# Altium schematic sheet TEC_DRV.SchDoc
size 420 x 297 mm; SheetNumber: 5; SheetTotal: 11
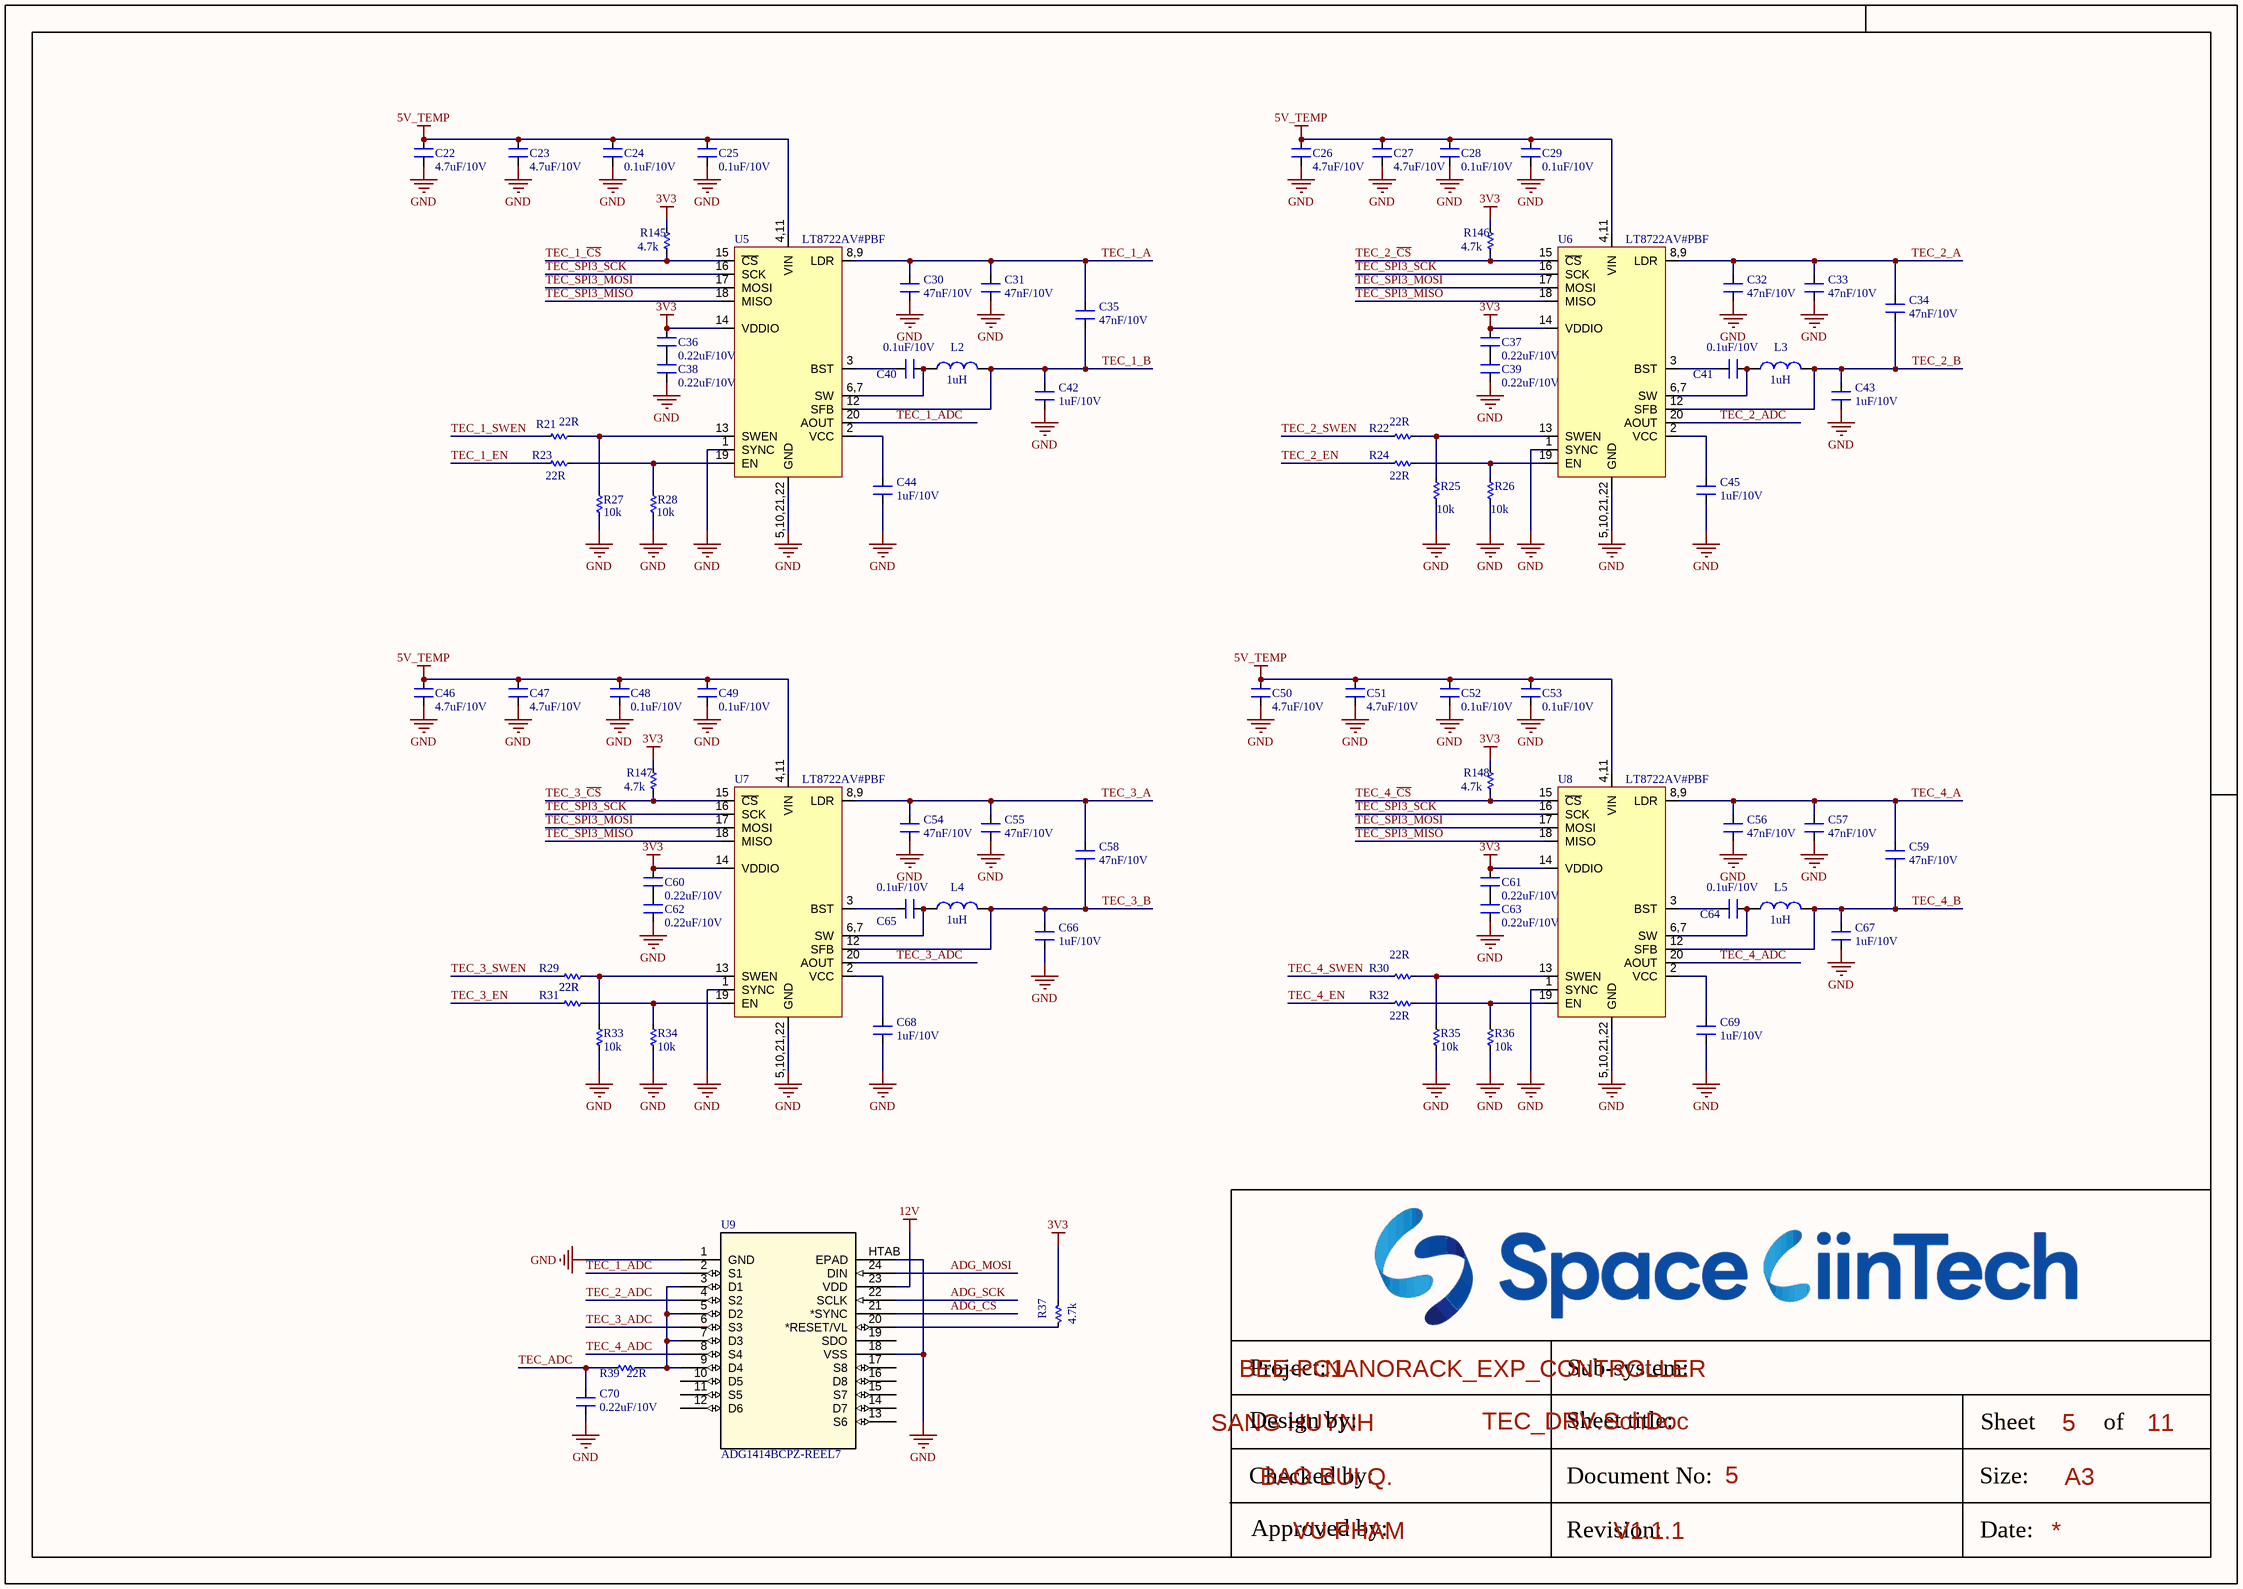
[diagram p0: TEC_DRV.SchDoc]

## Parts
C22  4.7uF/10V  [CAP_C_1608X80]
C23  4.7uF/10V  [CAP_C_1608X80]
C24  0.1uF/10V  [CAP_C_1608X80]
C25  0.1uF/10V  [CAP_C_1608X80]
C26  4.7uF/10V  [CAP_C_1608X80]
C27  4.7uF/10V  [CAP_C_1608X80]
C28  0.1uF/10V  [CAP_C_1608X80]
C29  0.1uF/10V  [CAP_C_1608X80]
C30  47nF/10V  [CAP_C_1608X80]
C31  47nF/10V  [CAP_C_1608X80]
C32  47nF/10V  [CAP_C_1608X80]
C33  47nF/10V  [CAP_C_1608X80]
C34  47nF/10V  [CAP_C_1608X80]
C35  47nF/10V  [CAP_C_1608X80]
C36  0.22uF/10V  [CAP_C_1608X80]
C37  0.22uF/10V  [CAP_C_1608X80]
C38  0.22uF/10V  [CAP_C_1608X80]
C39  0.22uF/10V  [CAP_C_1608X80]
C40  0.1uF/10V  [CAP_C_1608X80]
C41  0.1uF/10V  [CAP_C_1608X80]
C42  1uF/10V  [CAP_C_1608X80]
C43  1uF/10V  [CAP_C_1608X80]
C44  1uF/10V  [CAP_C_1608X80]
C45  1uF/10V  [CAP_C_1608X80]
C46  4.7uF/10V  [CAP_C_1608X80]
C47  4.7uF/10V  [CAP_C_1608X80]
C48  0.1uF/10V  [CAP_C_1608X80]
C49  0.1uF/10V  [CAP_C_1608X80]
C50  4.7uF/10V  [CAP_C_1608X80]
C51  4.7uF/10V  [CAP_C_1608X80]
C52  0.1uF/10V  [CAP_C_1608X80]
C53  0.1uF/10V  [CAP_C_1608X80]
C54  47nF/10V  [CAP_C_1608X80]
C55  47nF/10V  [CAP_C_1608X80]
C56  47nF/10V  [CAP_C_1608X80]
C57  47nF/10V  [CAP_C_1608X80]
C58  47nF/10V  [CAP_C_1608X80]
C59  47nF/10V  [CAP_C_1608X80]
C60  0.22uF/10V  [CAP_C_1608X80]
C61  0.22uF/10V  [CAP_C_1608X80]
C62  0.22uF/10V  [CAP_C_1608X80]
C63  0.22uF/10V  [CAP_C_1608X80]
C64  0.1uF/10V  [CAP_C_1608X80]
C65  0.1uF/10V  [CAP_C_1608X80]
C66  1uF/10V  [CAP_C_1608X80]
C67  1uF/10V  [CAP_C_1608X80]
C68  1uF/10V  [CAP_C_1608X80]
C69  1uF/10V  [CAP_C_1608X80]
C70  0.22uF/10V  [CAP_C_1608X80]
L2  1uH  [L-SMD-M-3.5x3.5x2mm]
L3  1uH  [L-SMD-M-3.5x3.5x2mm]
L4  1uH  [L-SMD-M-3.5x3.5x2mm]
L5  1uH  [L-SMD-M-3.5x3.5x2mm]
R21  22R  [RES_C_1608X60]
R22  22R  [RES_C_1608X60]
R23  22R  [RES_C_1608X60]
R24  22R  [RES_C_1608X60]
R25  10k  [RES_C_1608X60]
R26  10k  [RES_C_1608X60]
R27  10k  [RES_C_1608X60]
R28  10k  [RES_C_1608X60]
R29  22R  [RES_C_1608X60]
R30  22R  [RES_C_1608X60]
R31  22R  [RES_C_1608X60]
R32  22R  [RES_C_1608X60]
R33  10k  [RES_C_1608X60]
R34  10k  [RES_C_1608X60]
R35  10k  [RES_C_1608X60]
R36  10k  [RES_C_1608X60]
R37  4.7k  [RES_C_1608X60]
R39  22R  [RES_C_1608X60]
R145  4.7k  [RES_C_1608X60]
R146  4.7k  [RES_C_1608X60]
R147  4.7k  [RES_C_1608X60]
R148  4.7k  [RES_C_1608X60]
U5  LT8722AV#PBF  [QFN18]
U6  LT8722AV#PBF  [QFN18]
U7  LT8722AV#PBF  [QFN18]
U8  LT8722AV#PBF  [QFN18]
U9  ADG1414BCPZ-REEL7  [ADG1414BCPZ-REEL7]

## Nets
3V3: C36.2 C37.2 C60.2 C61.2 R37.2 R145.1 R146.1 R147.1 R148.1 U5.14(VDDIO) U6.14(VDDIO) U7.14(VDDIO) U8.14(VDDIO)
5V_TEMP: C22.2 C23.2 C24.2 C25.2 C26.2 C27.2 C28.2 C29.2 C46.2 C47.2 C48.2 C49.2 C50.2 C51.2 C52.2 C53.2 U5.4,11(VIN) U6.4,11(VIN) U7.4,11(VIN) U8.4,11(VIN)
12V: U9.23(VDD)
GND: C22.1 C23.1 C24.1 C25.1 C26.1 C27.1 C28.1 C29.1 C30.1 C31.1 C32.1 C33.1 C38.1 C39.1 C42.1 C43.1 C44.1 C45.1 C46.1 C47.1 C48.1 C49.1 C50.1 C51.1 C52.1 C53.1 C54.1 C55.1 C56.1 C57.1 C62.1 C63.1 C66.1 C67.1 C68.1 C69.1 C70.1 R25.2 R26.2 R27.2 R28.2 R33.1 R34.1 R35.1 R36.1 U5.1(SYNC) U5.5,10,21,22(GND) U6.1(SYNC) U6.5,10,21,22(GND) U7.1(SYNC) U7.5,10,21,22(GND) U8.1(SYNC) U8.5,10,21,22(GND) U9.1(GND) U9.18(VSS) U9.HTAB(EPAD)
ADG_CS: U9.21(*SYNC)
ADG_MOSI: U9.24(DIN)
ADG_SCK: U9.22(SCLK)
TEC_1_A: C30.2 C31.2 C35.2 U5.8,9(LDR)
TEC_1_ADC: U5.20(AOUT) U9.2(S1)
TEC_1_B: C35.1 C42.2 L2.2 U5.12(SFB)
TEC_1_~{CS}: R145.2 U5.15(~{CS})
TEC_1_EN: R23.1
TEC_1_SWEN: R21.1
TEC_2_A: C32.2 C33.2 C34.2 U6.8,9(LDR)
TEC_2_ADC: U6.20(AOUT) U9.4(S2)
TEC_2_B: C34.1 C43.2 L3.2 U6.12(SFB)
TEC_2_~{CS}: R146.2 U6.15(~{CS})
TEC_2_EN: R24.1
TEC_2_SWEN: R22.1
TEC_3_A: C54.2 C55.2 C58.2 U7.8,9(LDR)
TEC_3_ADC: U7.20(AOUT) U9.6(S3)
TEC_3_B: C58.1 C66.2 L4.2 U7.12(SFB)
TEC_3_~{CS}: R147.2 U7.15(~{CS})
TEC_3_EN: R31.1
TEC_3_SWEN: R29.1
TEC_4_A: C56.2 C57.2 C59.2 U8.8,9(LDR)
TEC_4_ADC: U8.20(AOUT) U9.8(S4)
TEC_4_B: C59.1 C67.2 L5.2 U8.12(SFB)
TEC_4_~{CS}: R148.2 U8.15(~{CS})
TEC_4_EN: R32.1
TEC_4_SWEN: R30.1
TEC_ADC: C70.2 R39.1
TEC_SPI3_MISO: U5.18(MISO) U6.18(MISO) U7.18(MISO) U8.18(MISO)
TEC_SPI3_MOSI: U5.17(MOSI) U6.17(MOSI) U7.17(MOSI) U8.17(MOSI)
TEC_SPI3_SCK: U5.16(SCK) U6.16(SCK) U7.16(SCK) U8.16(SCK)
NetC36_1: C36.1 C38.2
NetC37_1: C37.1 C39.2
NetC40_1: C40.1 L2.1 U5.6,7(SW)
NetC40_2: C40.2 U5.3(BST)
NetC41_1: C41.1 L3.1 U6.6,7(SW)
NetC41_2: C41.2 U6.3(BST)
NetC44_2: C44.2 U5.2(VCC)
NetC45_2: C45.2 U6.2(VCC)
NetC60_1: C60.1 C62.2
NetC61_1: C61.1 C63.2
NetC64_1: C64.1 L5.1 U8.6,7(SW)
NetC64_2: C64.2 U8.3(BST)
NetC65_1: C65.1 L4.1 U7.6,7(SW)
NetC65_2: C65.2 U7.3(BST)
NetC68_2: C68.2 U7.2(VCC)
NetC69_2: C69.2 U8.2(VCC)
NetR21_2: R21.2 R27.1 U5.13(SWEN)
NetR22_2: R22.2 R25.1 U6.13(SWEN)
NetR23_2: R23.2 R28.1 U5.19(EN)
NetR24_2: R24.2 R26.1 U6.19(EN)
NetR29_2: R29.2 R33.2 U7.13(SWEN)
NetR30_2: R30.2 R35.2 U8.13(SWEN)
NetR31_2: R31.2 R34.2 U7.19(EN)
NetR32_2: R32.2 R36.2 U8.19(EN)
NetR37_1: R37.1 U9.20(*RESET/VL)
NetR39_2: R39.2 U9.3(D1) U9.5(D2) U9.7(D3) U9.9(D4)

Not connected (* = marked no-connect by the designer): U9 10(D5) 11(S5) 12(D6) 13(S6) 14(D7) 15(S7) 16(D8) 17(S8) 19(SDO)

## Notes on the sheet
- Project:
- BEE-PC1
- Sub-system:
- NANORACK_EXP_CONTROLLER
- Design by:
- SANG HUYNH
- BAO BUI Q.
- Sheet title:
- Sheet
- A3
- of
- Checked by:
- Approved by:
- VU PHAM
- Revision:
- Document No:
- V1.1.1
- Size:
- Date:

## Library data of the parts
C22-C70 = Capacitors: Value: 33pF
L2-L5 = L-SMD-1: partNo: 78477010; Manufacturer: Wurth Elektronik; Inductance: 1.0 μH; ComponentLink1Description: Manufacturer; ComponentLink1URL: http://www.we-online.de; Created by: Baojun Chen; Created Date: Nov.2015; ComponentLink2Description: Datasheet; ComponentLink2URL: http://katalog.we-online.de/pbs/datasheet/78477010.pdf
R21-R37 R39 R145-R148 = Res SMD: SMD; Manufacturer: Generic Components; Class: Passive; Published: 08/06/2000; Publisher: Altium Hobart Technology Centre
U5-U8 = LT8722
U9 = ADG1414: IC SW SPST-NOX8 11.5OHM 24LFCSP